# Altium schematic sheet LoRa.SchDoc: LoRa
size A; Author: Craig Hesling; DrawnBy: Craig Hesling; Revision: 1
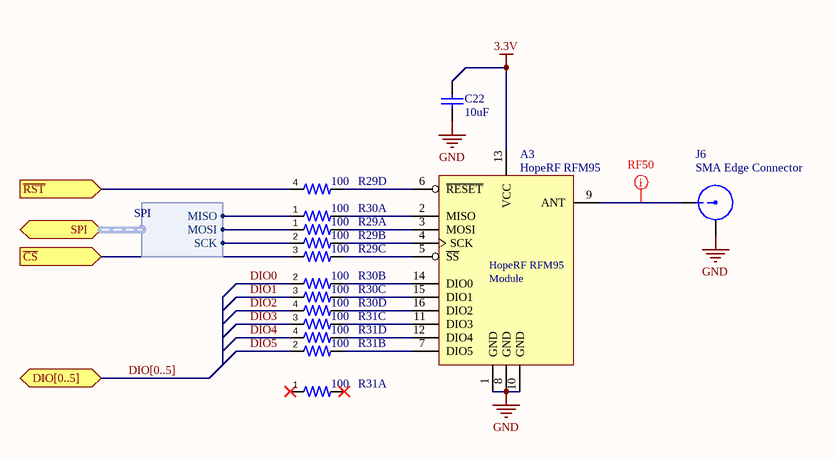
[diagram p0: LoRa.SchDoc]

## Parts
A3  HopeRF RFM95  [RFM95/9697/98W]
C22  10uF  [CAPC2013X14L - CAP0805 1.45mm Tall]
J6  SMA Edge Connector  [SMA Connector - Edge Mount]
R29  100  [CAC-80P319X159-8L]  (parts A,B,C,D of 4)
R30  100  [CAC-80P319X159-8L]  (parts A,B,C,D of 4)
R31  100  [CAC-80P319X159-8L]  (parts A,B,C,D of 4)

## Ports
DIO[0..5] (bidir), SPI (harness SPI), ~{CS} (in), ~{RST} (in)

## Harnesses
SPI: MISO, MOSI, SCK

## Nets
3.3V: A3.13(VCC) C22.2
GND: A3.1(GND) A3.8(GND) A3.10(GND) C22.1 J6.2(GND)
~{CS}: R29.3 ; port ~{CS}
DIO0: R30.2
DIO1: R30.3
DIO2: R30.4
DIO3: R31.3
DIO4: R31.4
DIO5: R31.2
~{RST}: R29.4 ; port ~{RST}
NetA3_2: A3.2(MISO) R30.8
NetA3_3: A3.3(MOSI) R29.8
NetA3_4: A3.4(SCK) R29.7
NetA3_5: A3.5(~{SS}) R29.6
NetA3_6: A3.6(~{RESET}) R29.5
NetA3_7: A3.7(DIO5) R31.7
NetA3_9: A3.9(ANT) J6.1(Signal)
NetA3_11: A3.11(DIO3) R31.6
NetA3_12: A3.12(DIO4) R31.5
NetA3_14: A3.14(DIO0) R30.7
NetA3_15: A3.15(DIO1) R30.6
NetA3_16: A3.16(DIO2) R30.5
NetR29_1: R29.1 ; port SPI.MOSI
NetR29_2: R29.2 ; port SPI.SCK
NetR30_1: R30.1 ; port SPI.MISO

Not connected (* = marked no-connect by the designer): R31 1* 8*

## Buses and harness runs
bus DIO[0..5] = port DIO[0..5]

## Layout directives
net class RF50: NetA3_9

## Notes on the sheet
- (in symbol RFM95) Module

## Library data of the parts
A3 = RFM95: HopeRF RFM95 915MHz LoRa Radio; Supplier 1: Digi-Key; Supplier 2: Digi-Key; Supplier Part Number 1: 1597-1488-ND; Supplier Part Number 2: RFM95W-915S2-ND
C22 = CAP0805 10uF 10% 6.3V X5R: SMT 0805 Ceramic Capacitor; TempCoeff: X5R; Tolerance: 10%; Voltage: 6.3V; Value: 10uF; Supplier 1: Digi-Key; Supplier Part Number 1: 1276-6457-1-ND
R29-R31 = RESARR1206 100 5% 1/16W: Tolerance: 5%; Power: 1/16W; Supplier 1: Digi-Key; Supplier Part Number 1: YC164J-100CT-ND; Value: 100
J6 = SMA Edge Connector: Supplier 1: Digi-Key; Supplier 2: Digi-Key; Supplier 3: Digi-Key; Supplier Part Number 1: CON-SMA-EDGE-S-ND; Supplier Part Number 2: 931-1174-ND; Supplier Part Number 3: 931-1175-ND